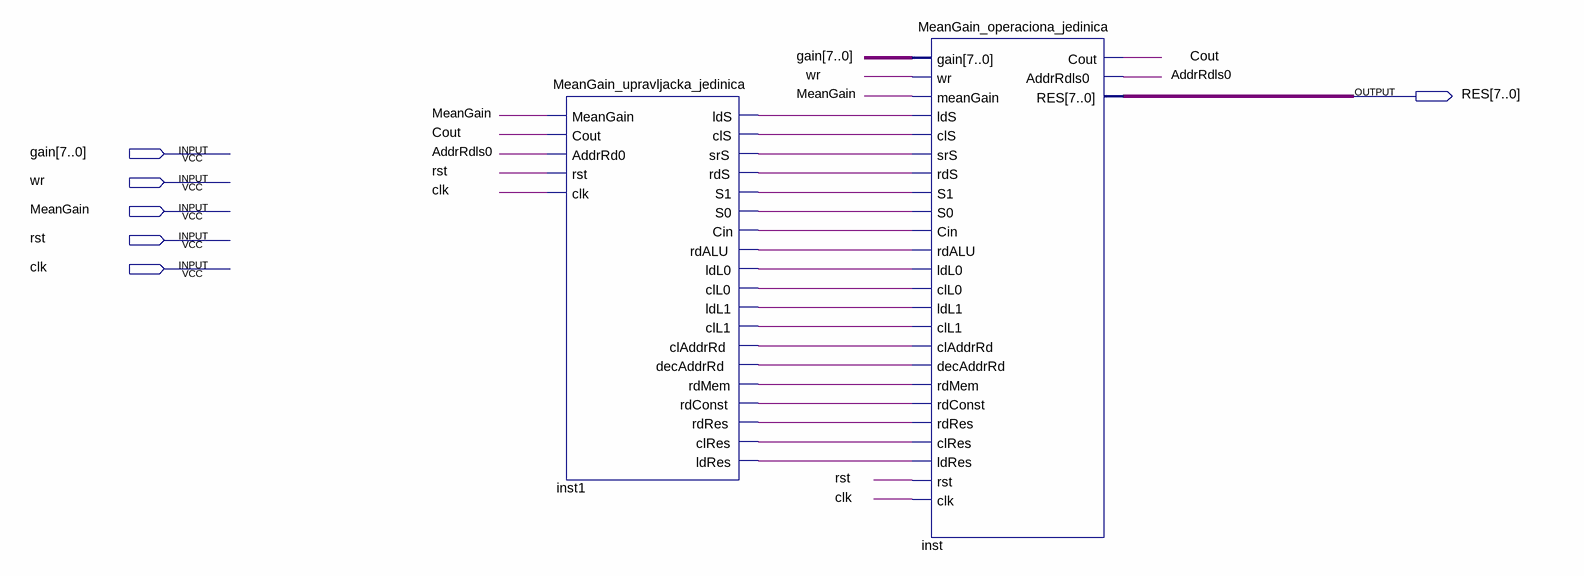
[diagram p0: schematic sheet]
// Quartus schematic MeanGain.bdf as structural Verilog: 2 symbols, 6 pins
module MeanGain (
  input  [7:0] gain,
  input  wr,
  input  MeanGain,
  input  rst,
  input  clk,
  output [7:0] RES
);

  wire AddrRdls0, Cout, inst1_cin, inst1_claddrrd, inst1_cll0, inst1_cll1, inst1_clres, inst1_cls,
       inst1_decaddrrd, inst1_ldl0, inst1_ldl1, inst1_ldres, inst1_lds, inst1_rdalu, inst1_rdconst,
       inst1_rdmem, inst1_rdres, inst1_rds, inst1_s0, inst1_s1, inst1_srs;

  MeanGain_upravljacka_jedinica inst1 (
    .MeanGain(MeanGain), .Cout(Cout), .AddrRd0(AddrRdls0), .rst(rst), .clk(clk), .ldS(inst1_lds),
    .clS(inst1_cls), .srS(inst1_srs), .rdS(inst1_rds), .S1(inst1_s1), .S0(inst1_s0), .Cin(inst1_cin),
    .rdALU(inst1_rdalu), .ldL0(inst1_ldl0), .clL0(inst1_cll0), .ldL1(inst1_ldl1), .clL1(inst1_cll1),
    .clAddrRd(inst1_claddrrd), .decAddrRd(inst1_decaddrrd), .rdMem(inst1_rdmem), .rdConst(inst1_rdconst),
    .rdRes(inst1_rdres), .clRes(inst1_clres), .ldRes(inst1_ldres));
  MeanGain_operaciona_jedinica inst (
    .gain(gain), .wr(wr), .meanGain(MeanGain), .ldS(inst1_lds), .clS(inst1_cls), .srS(inst1_srs),
    .rdS(inst1_rds), .S1(inst1_s1), .S0(inst1_s0), .Cin(inst1_cin), .rdALU(inst1_rdalu), .ldL0(inst1_ldl0),
    .clL0(inst1_cll0), .ldL1(inst1_ldl1), .clL1(inst1_cll1), .clAddrRd(inst1_claddrrd),
    .decAddrRd(inst1_decaddrrd), .rdMem(inst1_rdmem), .rdConst(inst1_rdconst), .rdRes(inst1_rdres),
    .clRes(inst1_clres), .ldRes(inst1_ldres), .rst(rst), .clk(clk), .Cout(Cout), .AddrRdls0(AddrRdls0),
    .RES(RES));
endmodule
